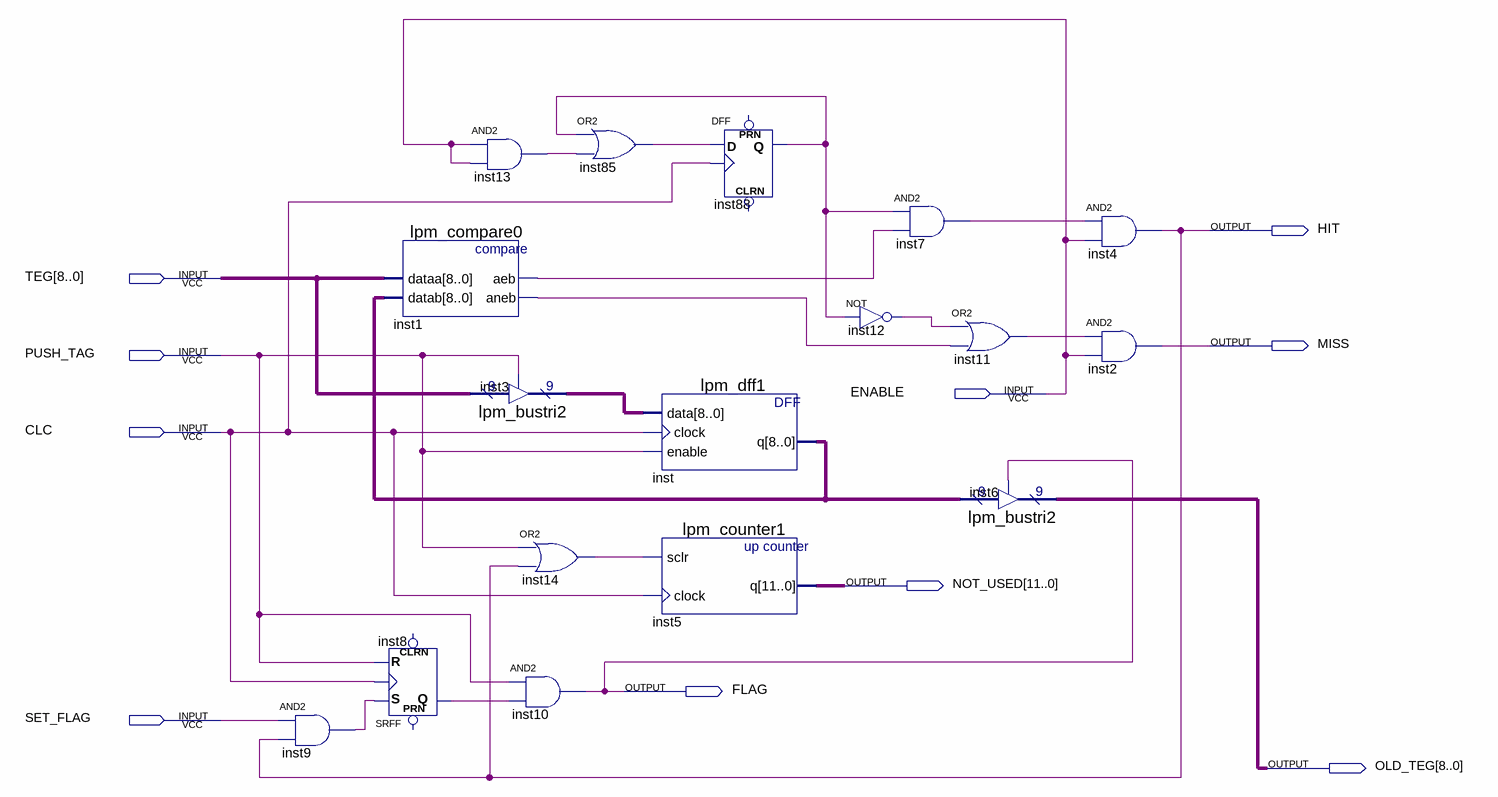
[diagram p0: schematic sheet]
// Quartus schematic TAG.bdf as structural Verilog: 17 symbols, 10 pins
module TAG (
  input  [8:0] TEG,
  input  PUSH_TAG,
  input  ENABLE,
  input  CLC,
  input  SET_FLAG,
  output HIT,
  output MISS,
  output [11:0] NOT_USED,
  output FLAG,
  output [8:0] OLD_TEG
);

  wire inst1_aeb, inst1_aneb, inst7_out, inst8_q, inst9_out, inst11_out, inst12_out, inst13_out, inst14_out,
       inst85_out, inst88_q;
  wire [8:0] inst3_tridata, inst_q;

  and inst9 (inst9_out, SET_FLAG, HIT);
  lpm_compare0 inst1 (.dataa(TEG), .datab(inst_q), .aeb(inst1_aeb), .aneb(inst1_aneb));
  SRFF inst8 (.S(inst9_out), .R(PUSH_TAG), .CLK(CLC), .Q(inst8_q));  // open: PRN, CLRN
  and inst13 (inst13_out, ENABLE, ENABLE);
  lpm_bustri2 inst3 (.enabledt(PUSH_TAG), .data(TEG), .tridata(inst3_tridata));
  or inst85 (inst85_out, inst88_q, inst13_out);
  or inst14 (inst14_out, PUSH_TAG, HIT);
  and inst10 (FLAG, PUSH_TAG, inst8_q);
  lpm_dff1 inst (.data(inst3_tridata), .clock(CLC), .enable(PUSH_TAG), .q(inst_q));
  lpm_counter1 inst5 (.sclr(inst14_out), .clock(CLC), .q(NOT_USED));
  DFF inst88 (.CLK(CLC), .D(inst85_out), .Q(inst88_q));  // open: CLRN, PRN
  not inst12 (inst12_out, inst88_q);
  and inst7 (inst7_out, inst88_q, inst1_aeb);
  or inst11 (inst11_out, inst12_out, inst1_aneb);
  lpm_bustri2 inst6 (.enabledt(FLAG), .data(inst_q), .tridata(OLD_TEG));
  and inst4 (HIT, inst7_out, ENABLE);
  and inst2 (MISS, inst11_out, ENABLE);
endmodule
